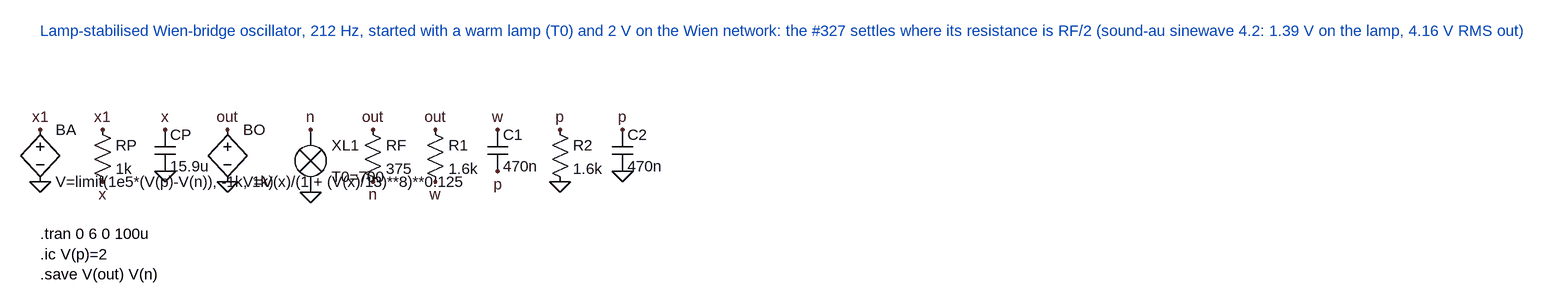
[diagram p0: schematic demo_lamp.asc]
demo_lamp.asc, the LTspice schematic file:
Version 4
SHEET 1 1100 520
FLAG 0 112 x1
FLAG 0 192 0
FLAG 96 112 x1
FLAG 96 192 x
FLAG 192 112 x
FLAG 192 176 0
FLAG 288 112 out
FLAG 288 192 0
FLAG 416 112 n
FLAG 416 208 0
FLAG 512 112 out
FLAG 512 192 n
FLAG 608 112 out
FLAG 608 192 w
FLAG 704 112 w
FLAG 704 176 p
FLAG 800 112 p
FLAG 800 192 0
FLAG 896 112 p
FLAG 896 176 0
SYMBOL bv 0 96 R0
SYMATTR InstName BA
SYMATTR Value V=limit(1e5*(V(p)-V(n)), -1k, 1k)
SYMBOL res 80 96 R0
SYMATTR InstName RP
SYMATTR Value 1k
SYMBOL cap 176 112 R0
SYMATTR InstName CP
SYMATTR Value 15.9u
SYMBOL bv 288 96 R0
SYMATTR InstName BO
SYMATTR Value V=V(x)/(1 + (V(x)/13)**8)**0.125
SYMBOL LAMP_327 400 96 R0
SYMATTR InstName XL1
SYMATTR Value T0=700
SYMBOL res 496 96 R0
SYMATTR InstName RF
SYMATTR Value 375
SYMBOL res 592 96 R0
SYMATTR InstName R1
SYMATTR Value 1.6k
SYMBOL cap 688 112 R0
SYMATTR InstName C1
SYMATTR Value 470n
SYMBOL res 784 96 R0
SYMATTR InstName R2
SYMATTR Value 1.6k
SYMBOL cap 880 112 R0
SYMATTR InstName C2
SYMATTR Value 470n
TEXT 0 272 Left 2 !.tran 0 6 0 100u\n.ic V(p)=2\n.save V(out) V(n)
TEXT 0 -40 Left 2 ;Lamp-stabilised Wien-bridge oscillator, 212 Hz, started with a warm lamp (T0) and 2 V on the Wien network: the #327 settles where its resistance is RF/2 (sound-au sinewave 4.2: 1.39 V on the lamp, 4.16 V RMS out)

The netlist it stands for:
* demo_lamp.asc
BA x1 0 V=limit(1e5*(V(p)-V(n)), -1k, 1k)
RP x1 x 1k
CP x 0 15.9u
BO out 0 V=V(x)/(1 + (V(x)/13)**8)**0.125
XXL1 n 0 LAMP_327 T0=700  ; pins A B
RF out n 375
R1 out w 1.6k
C1 w p 470n
R2 p 0 1.6k
C2 p 0 470n
.tran 0 6 0 100u
.ic V(p)=2
.save V(out) V(n)
* Lamp-stabilised Wien-bridge oscillator, 212 Hz, started with a warm lamp (T0) and 2 V on the Wien network: the #327 settles where its resistance is RF/2 (sound-au sinewave 4.2: 1.39 V on the lamp, 4.16 V RMS out)
.lib lamp.sub
.backanno
.end